# EasyEDA Pro project 小智.epro, board ESP32-S3-V1_0_1
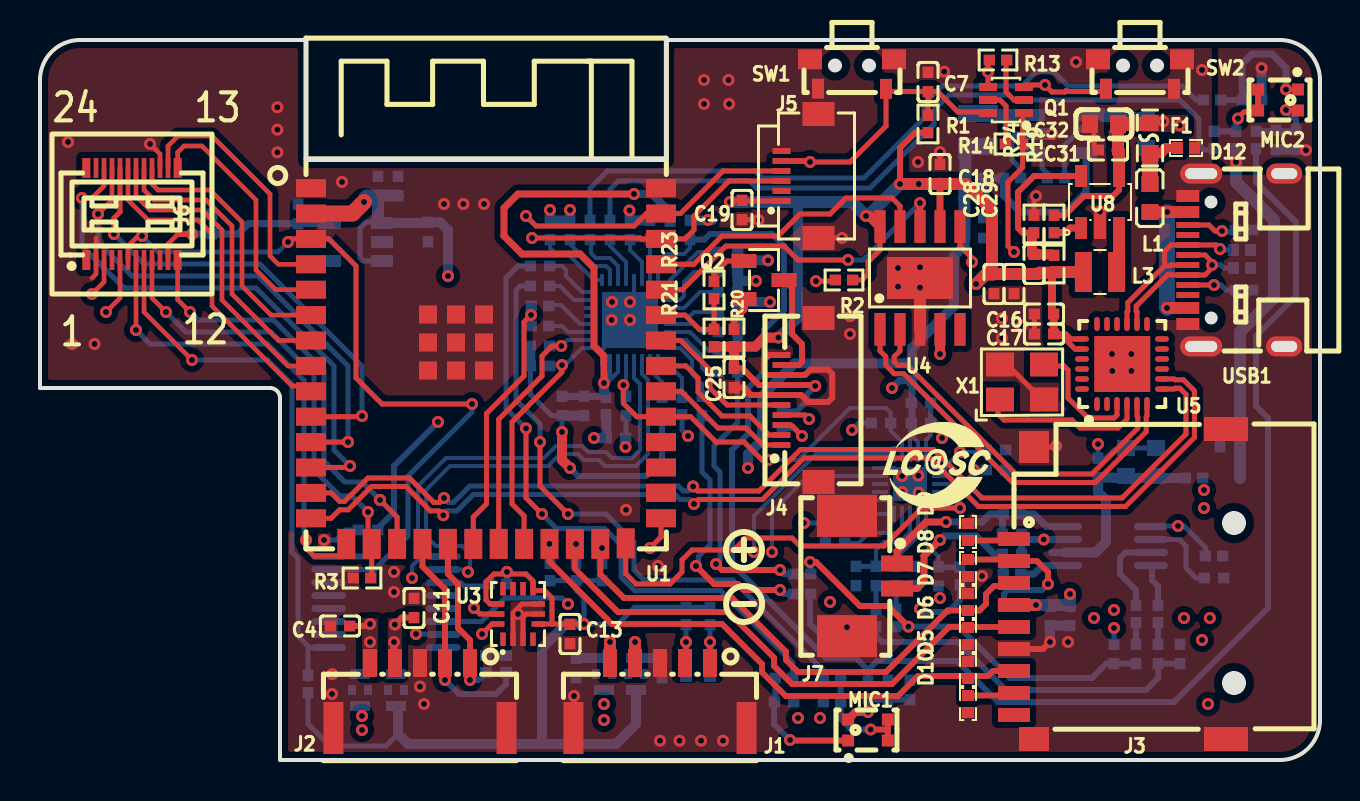
[diagram p3: board, top side]
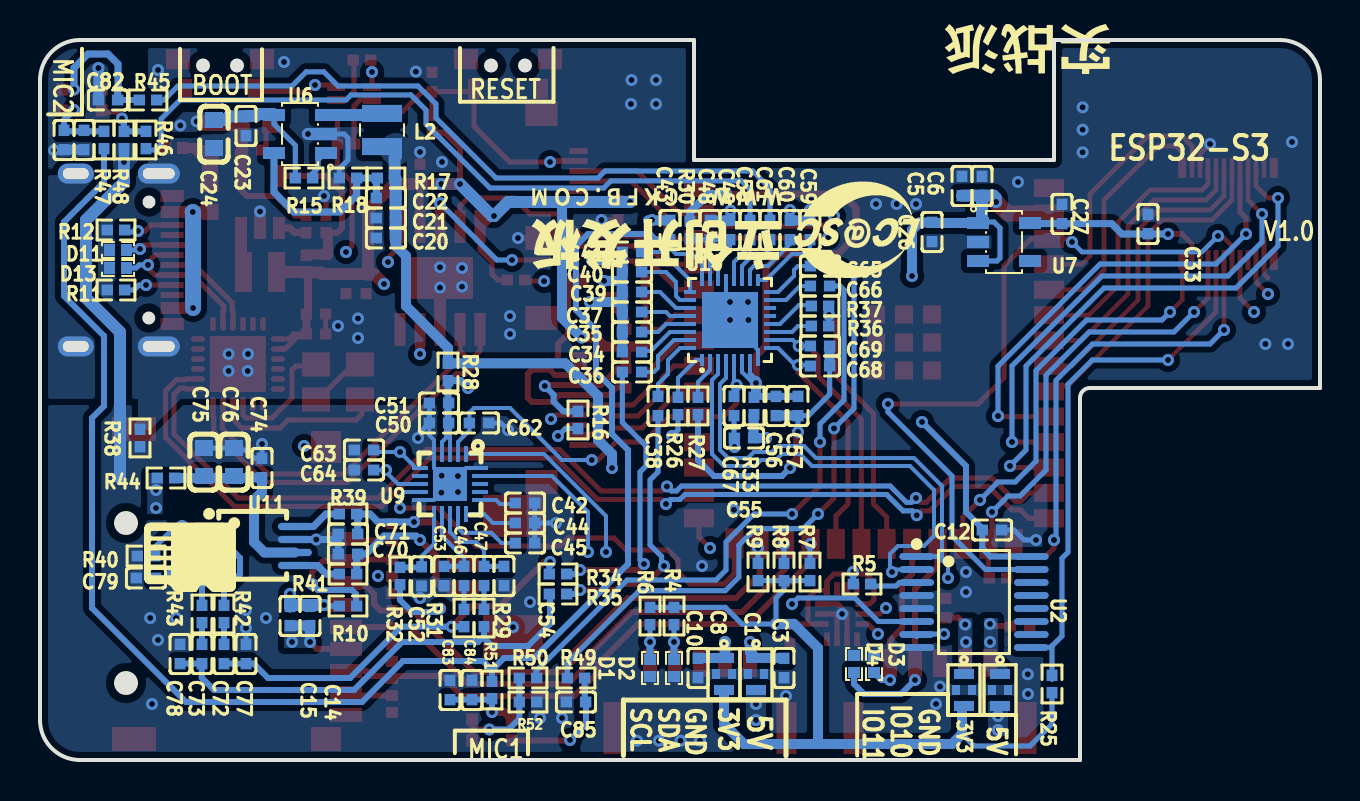
[diagram p4: board, bottom side, seen from below]

Outline 64 x 36 mm; copper layers: Top Layer, Inner1, Inner2, Bottom Layer. Coordinates in mm from the lower left corner of the outline.
Outline path: 0,34 0,18.6 11.5,18.6 arc(11.85,18.45) 12,18.1 12,0 62,0 arc(63.41,0.59) 64,2 64,34 arc(63.42,35.41) 62,36 31.3,36 31.3,30 13.3,30 13.3,36 2,36 arc(0.59,35.41) 0,34
Stack: Top Layer 0.035mm 外层铜厚1oz / Dielectric1 0.2104mm 7628 RC49% 8.6mil / Inner1 0.0152mm 内层铜厚 / Dielectric2 1.065mm 1.1mm H/HOZ 含铜 / Inner2 0.0152mm 内层铜厚 / Dielectric3 0.2104mm 7628 RC49% 8.6mil / Bottom Layer 0.035mm 外层铜厚1oz

## Design rules (mm)
net IO19_USB_D-: DP2
net IO20_USB_D+: DP2
net USB_D-: DP1
net USB_D+: DP1
net CH340_D-: DP3
net CH340_D+: DP3
template: 自定义配置
spacing copperThickness1oz (default): track to track 0.15, other pairs 0.152 to 0.3
spacing copperThickness2oz: track to track 0.203, other pairs 0.152 to 0.3
track width copperThickness1oz (default): min 0.15, default 0.254, max 2.54
track width copperThickness2oz: min 0.203, default 0.254, max 2.54
differential pair differentialPair (default): width min 0.15, default 0.253, max 2.54; gap min 0.17, default 0.17
via viaSize (default): diameter min 0.5, default 0.6, max 10; hole min 0.3, default 0.3, max 6.3

## Placement (name value [footprint] x y rotation side)
C1  NFM18PC104R1C3D  [FILTER-SMD_3P-L1.6-W0.8-L_NFM18CC223R1C3D]  28.2 4.3 270 bottom
C2  NFM18PC104R1C3D  [FILTER-SMD_3P-L1.6-W0.8-L_NFM18CC223R1C3D]  16 3.5 270 bottom
C3  100nF  [C0402]  26.8 4.6 270 bottom
C4  100nF  [C0402]  15 6.7 180 top
C5  10uF  [C0402]  17.9 28.7 90 bottom
C6  100nF  [C0402]  16.9 28.7 90 bottom
C7  1uF  [C0402]  44.4 33.9 90 top
C8  NFM18PC104R1C3D  [FILTER-SMD_3P-L1.6-W0.8-L_NFM18CC223R1C3D]  29.8 4.3 270 bottom
C9  NFM18PC104R1C3D  [FILTER-SMD_3P-L1.6-W0.8-L_NFM18CC223R1C3D]  17.8 3.5 270 bottom
C10  100nF  [C0402]  31.1 4.6 270 bottom
C11  100nF  [C0402]  18.7 7.6 90 top
C12  100nF  [C0402]  16.4 11.5 180 bottom
C13  100nF  [C0402]  26.5 6.3 90 top
C14  10uF  [C0402]  50.5 7.2 90 bottom
C15  100nF  [C0402]  51.5 7.2 90 bottom
C16  10uF  [C0402]  50.2 22.3 0 top
C17  100nF  [C0402]  50.2 21.3 180 top
C18  100nF  [C0402]  45 29.3 270 top
C19  100nF  [C0402]  35.1 27.5 90 top
C20  10uF  [C0402]  46.7 26.1 180 bottom
C21  100nF  [C0402]  46.7 27.1 0 bottom
C22  22pF  [C0402]  46.7 28.1 180 bottom
C23  100nF  [C0402]  53.7 31.7 270 bottom
C24  10uF  [C0603]  55.3 31.3 90 bottom
C25  100nF  [C0402]  34.7 19.1 270 top
C26  1uF  [C0402]  19.4 26.4 270 bottom
C27  1uF  [C0402]  12.9 27.3 90 bottom
C28  10uF  [C0402]  47.7 23.8 90 top
C29  100nF  [C0402]  48.7 23.8 270 top
C30  22pF  [C0402]  49.7 24.8 270 top
C31  100nF  [C0402]  53.4 30.5 180 top
C32  10uF  [C0603]  53.2 31.8 0 top
C33  100nF  [C0402]  8.6 26.8 270 bottom
C34  1uF  [C0402]  34.4 20.4 0 bottom
C35  1uF  [C0402]  34.4 21.4 0 bottom
C36  1uF  [C0402]  34.4 19.4 180 bottom
C37  1uF  [C0402]  34.4 22.4 0 bottom
C38  1uF  [C0402]  33.1 17.7 90 bottom
C39  1uF  [C0402]  34.4 23.4 0 bottom
C40  1uF  [C0402]  34.4 24.4 0 bottom
C41  1uF  [C0402]  34.4 25.4 0 bottom
C42  1uF  [C0402]  39.75 12.85 0 bottom
C43  1uF  [C0402]  32.5 26.5 90 bottom
C44  1uF  [C0402]  39.75 11.85 0 bottom
C45  1uF  [C0402]  39.75 10.85 0 bottom
C46  1uF  [C0402]  42.8 9.2 90 bottom
C47  1uF  [C0402]  41.8 9.2 90 bottom
C48  1uF  [C0402]  30.5 26.5 90 bottom
C49  1uF  [C0402]  29.5 26.5 90 bottom
C50  100nF  [C0402]  44.05 16.85 180 bottom
C51  100nF  [C0402]  44.05 17.85 180 bottom
C52  1uF  [C0402]  44.92 9.18 90 bottom
C53  22pF  [C0402]  43.8 9.2 90 bottom
C54  22pF  [C0402]  40.8 9.2 90 bottom
C55  1uF  [C0402]  28.8 16.1 180 bottom
C56  100nF  [C0402]  27.2 17.7 90 bottom
C57  100nF  [C0402]  26.1 17.7 90 bottom
C58  1uF  [C0402]  28.5 26.5 270 bottom
C59  1uF  [C0402]  25.5 26.5 90 bottom
C60  1uF  [C0402]  26.5 26.5 90 bottom
C61  1uF  [C0402]  27.5 26.5 270 bottom
C62  22pF  [C0402]  42.05 16.85 0 bottom
C63  22pF  [C0402]  47.8 15.5 180 bottom
C64  22pF  [C0402]  47.8 14.5 180 bottom
C65  1uF  [C0402]  25 24.7 0 bottom
C66  1uF  [C0402]  25 23.7 0 bottom
C67  22pF  [C0402]  29.3 17.7 90 bottom
C68  22pF  [C0402]  25 19.7 0 bottom
C69  22pF  [C0402]  25 20.7 0 bottom
C70  1nF  [C0402]  48.6 10.3 180 bottom
C71  1nF  [C0402]  48.6 11.3 180 bottom
C72  100nF  [C0402]  54.8 5.3 90 bottom
C73  100nF  [C0402]  55.9 5.3 90 bottom
C74  1uF  [C0402]  52.9 14.6 270 bottom
C75  22uF  [C0603]  55.8 14.9 90 bottom
C76  22uF  [C0603]  54.3 14.9 90 bottom
C77  22pF  [C0402]  53.7 5.3 270 bottom
C78  22pF  [C0402]  57 5.3 270 bottom
C79  1uF  [C0402]  58.7 9.1 180 bottom
C80  100nF  [C0402]  62.8 31 270 bottom
C81  10uF  [C0402]  61.8 31 90 bottom
C82  22pF  [C0402]  60.6 33 180 bottom
C83  100nF  [C0402]  43.5 3.5 90 bottom
C84  10uF  [C0402]  42.4 3.5 270 bottom
C85  22pF  [C0402]  37.2 2.9 180 bottom
D1  RCLAMP0521T-ES  [DFN1006-2L-BI]  33.5 4.6 270 bottom
D2  RCLAMP0521T-ES  [DFN1006-2L-BI]  32.3 4.6 270 bottom
D3  RCLAMP0521T-ES  [DFN1006-2L-BI]  22.3 4.8 90 bottom
D4  RCLAMP0521T-ES  [DFN1006-2L-BI]  23.3 4.8 90 bottom
D5  RCLAMP0521T-ES  [DFN1006-2L-BI]  46.4 4.5 90 top
D6  RCLAMP0521T-ES  [DFN1006-2L-BI]  46.4 6.2 270 top
D7  RCLAMP0521T-ES  [DFN1006-2L-BI]  46.4 7.9 90 top
D8  RCLAMP0521T-ES  [DFN1006-2L-BI]  46.4 9.6 270 top
D9  RCLAMP0521T-ES  [DFN1006-2L-BI]  46.4 11.4 90 top
D10  RCLAMP0521T-ES  [DFN1006-2L-BI]  46.4 2.8 270 top
D11  RCLAMP0521T-ES  [DFN1006-2L-BI]  60.1 25.5 180 bottom
D12  RCLAMP0521T-ES  [DFN1006-2L-BI]  57.3 30.6 180 top
D13  RCLAMP0521T-ES  [DFN1006-2L-BI]  60.1 24.6 180 bottom
F1  BSMD0603L-100  [F0603]  55.5 31.1 270 top
J1  HC-GH-5PWT  [CONN-SMD_5P-P1.25_HC-GH-5PWTKK]  31 3.3 180 top
J2  HC-GH-5PWT  [CONN-SMD_5P-P1.25_HC-GH-5PWTKK]  19 3.3 180 top
J3  TF PUSH  [TF-SMD_TF-PUSH]  54 8.8 90 top
J4  AFC34-S10FIA-00  [FPC-SMD_AFC34-S10FIA-00]  38 18 90 top
J5  AFC34-S06FIA-00  [FPC-SMD_AFC34-S06FIA-00]  38 29.2 90 top
J6  AXK724147G  [CONN-SMD_AXK724147G]  4.6 27.3 0 top
J7  X9821WRS-02-9TSN  [CONN-SMD_2P-P1.25_X9821WRS-02-9TSN]  41.6 9.2 270 top
L1  UPZ1608U221-2R2TF  [L0603]  55.5 28.1 90 top
L2  2.2uH  [IND-SMD_L2.5-W2.0-VLS252012CX-150M]  46.9 31.5 90 bottom
L3  2.2uH  [IND-SMD_L2.5-W2.0-VLS252012CX-150M]  53 24.4 0 top
MIC1  ZTS6216  [MIC-SMD_4P-L2.8-W1.9-P1.84-TL]  41.4 1.5 90 top
MIC2  ZTS6216  [MIC-SMD_4P-L2.8-W1.9-P1.84-TL]  61.9 33 270 top
Q1  LMBT3904DW1T1G  [SOT-363_L2.0-W1.3-P0.65-LS2.1-BR]  48.3 33 0 top
Q2  SI2301CDS-T1-GE3-ES  [SOT-23-3_L2.9-W1.3-P1.90-LS2.4-BR]  36.2 24 180 top
R1  10kΩ  [R0402]  44.4 31.8 90 top
R2  10kΩ  [R0402]  40.2 24 180 top
R3  10kΩ  [R0402]  16.1 9.1 0 top
R4  1kΩ  [R0402]  32.3 7.2 270 bottom
R5  10kΩ  [R0402]  22.9 8.8 180 bottom
R6  1kΩ  [R0402]  33.5 7.2 270 bottom
R7  51kΩ  [R0402]  25.5 9.4 270 bottom
R8  51kΩ  [R0402]  26.8 9.4 270 bottom
R9  51kΩ  [R0402]  28.1 9.4 270 bottom
R10  51kΩ  [R0402]  48.6 7.7 0 bottom
R11  5.1kΩ  [R0402]  60.2 23.5 180 bottom
R12  5.1kΩ  [R0402]  60.2 26.5 0 bottom
R13  10kΩ  [R0402]  47.9 35 180 top
R14  10kΩ  [R0402]  48.7 30.8 0 top
R15  10kΩ  [R0402]  50.8 29.1 0 bottom
R16  10kΩ  [R0402]  37.1 17 90 bottom
R17  680kΩ  [R0402]  46.7 29.1 180 bottom
R18  150kΩ  [R0402]  48.6 29.1 180 bottom
R19  10kΩ  [R0402]  50.7 26.8 90 top
R20  10Ω  [R0402]  34.7 21.1 90 top
R21  10kΩ  [R0402]  33.7 21.1 270 top
R22  680kΩ  [R0402]  50.7 24.8 270 top
R23  1kΩ  [R0402]  33.7 23.5 90 top
R24  150kΩ  [R0402]  49.7 26.8 270 top
R25  10kΩ  [R0402]  13.4 3.8 270 bottom
R26  10kΩ  [R0402]  32.1 17.7 270 bottom
R27  10kΩ  [R0402]  31.1 17.7 270 bottom
R28  0Ω  [R0402]  43.6 19.4 270 bottom
R29  0Ω  [R0402]  41.8 7.1 270 bottom
R30  0Ω  [R0402]  31.5 26.5 90 bottom
R31  0Ω  [R0402]  42.8 7.1 270 bottom
R32  0Ω  [R0402]  46 9.2 90 bottom
R33  0Ω  [R0402]  28.3 17.7 90 bottom
R34  0Ω  [R0402]  38.1 9.3 180 bottom
R35  0Ω  [R0402]  38.1 8.3 180 bottom
R36  51Ω  [R0402]  25 21.7 0 bottom
R37  0Ω(NC)  [R0402]  25 22.7 0 bottom
R38  0Ω  [R0402]  59 16.1 90 bottom
R39  0Ω  [R0402]  48.6 12.3 180 bottom
R40  10kΩ  [R0402]  58.7 10.2 0 bottom
R41  0Ω  [R0402]  48.6 9.3 180 bottom
R42  100kΩ  [R0402]  54.8 7.3 270 bottom
R43  100kΩ  [R0402]  55.9 7.3 270 bottom
R44  0Ω  [R0402]  57.7 14.1 0 bottom
R45  0Ω  [R0402]  58.6 33 0 bottom
R46  0Ω  [R0402]  58.7 31 90 bottom
R47  0Ω  [R0402]  60.8 31 270 bottom
R48  0Ω  [R0402]  59.8 31 90 bottom
R49  0Ω  [R0402]  37.2 4.1 180 bottom
R50  0Ω  [R0402]  39.6 4.1 0 bottom
R51  0Ω  [R0402]  41.4 3.5 90 bottom
R52  0Ω  [R0402]  39.6 2.9 0 bottom
SW1  TS-1010-C-A  [KEY-SMD_TX-1010-X-X]  40.6 34.4 0 top
SW2  TS-1010-C-A  [KEY-SMD_TX-1010-X-X]  55 34.4 0 top
U1  ESP32-S3-WROOM-1-N16R8  [WIRELM-SMD_ESP32-S3-WROOM-1]  22.3 19.7 0 top
U2  PCA9557PW,118  [TSSOP-16_L5.0-W4.4-P0.65-LS6.4-BL]  17.3 7.9 270 bottom
U3  QMI8658A  [LGA-14_L3.0-W2.5-P0.50-TL]  23.9 7.3 90 top
U4  CH340K  [ESOP-10_L4.9-W3.9-P1.00-LS6.0-BL-EP]  44 24.1 0 top
U5  CH334F  [QFN-24_L4.0-W4.0-P0.50-BL-EP2.8]  54.1 19.8 0 top
U6  SY8088AAC  [SOT-23-5_L3.0-W1.7-P0.95-LS2.8-BR]  51 31.3 180 bottom
U7  ME6211C28M5G-N  [SOT-23-5_L3.0-W1.7-P0.95-LS2.8-BR]  15.8 25.9 0 bottom
U8  SY8088AAC  [SOT-23-5_L3.0-W1.7-P0.95-LS2.8-BR]  53 27.9 270 top
U9  ES8311  [WQFN-20_L3.0-W3.0-P0.40-BL-EP1.7]  43.5 13.8 0 bottom
U10  ES7210  [QFN-32_L4.0-W4.0-P0.40-BL-EP2.7]  29.5 22 180 bottom
U11  NS4150B  [MSOP-8_L3.0-W3.0-P0.65-LS5.0-BL]  53.4 10.7 270 bottom
USB1  TYPEC-304-ACP16  [USB-C-SMD_TYPE-C-16P-1]  59.8 25 90 top
X1  12MHz  [OSC-SMD_4P-L3.2-W2.5-BL]  49.1 18.9 0 top

## Footprints (pads in the part's own frame, mm; a bottom-side part is the same pattern mirrored in y, then rotated)
C0402
  rect 0.566x0.54 smd: 1(-0.481,0) 2(0.481,0)
C0603
  rect 0.8x0.9 smd: 1(-0.7,0) 2(0.7,0)
CONN-SMD_2P-P1.25_X9821WRS-02-9TSN
  rect 0.8x1.6 smd: 1(-0.625,1.25) 2(0.625,1.25)
  rect 2.1x3 smd: 3(3.005,-1.25) 4(-3.005,-1.25)
CONN-SMD_5P-P1.25_HC-GH-5PWTKK
  rect 0.7x1.4 smd: 1(-2.5,-1.55) 2(-1.25,-1.55) 3(0,-1.55) 4(1.25,-1.55) 5(2.5,-1.55)
  rect 1x2.6 smd: 6(-4.33,1.7) 7(4.33,1.7)
CONN-SMD_AXK724147G
  rect 0.4x1 smd: 1(-2.285,-2.3) 12(2.285,-2.3) 13(2.285,2.3) 24(-2.285,2.3)
  rect 0.23x1 smd: 2(-1.8,-2.3) 3(-1.399,-2.3) 4(-1,-2.3) 5(-0.6,-2.3) 6(-0.2,-2.3) 7(0.201,-2.3) 8(0.601,-2.3) 9(1,-2.3) 10(1.4,-2.3) 11(1.8,-2.3) 14(1.8,2.3) 15(1.4,2.3) 16(1,2.3) 17(0.601,2.3) 18(0.201,2.3) 19(-0.2,2.3) 20(-0.6,2.3) 21(-1,2.3) 22(-1.399,2.3) 23(-1.8,2.3)
DFN1006-2L-BI
  rect 0.55x0.6 smd: 1(-0.425,0) 2(0.425,0)
ESOP-10_L4.9-W3.9-P1.00-LS6.0-BL-EP
  rect 0.56x1.64 smd: 1(-2,-2.57) 2(-1,-2.57) 3(0,-2.57) 4(1,-2.57) 5(2,-2.57) 6(2,2.57) 7(1,2.57) 8(0,2.57) 9(-1,2.57) 10(-2,2.57)
  rect 3.3x2.1 smd: 11(0,0)
F0603
  rect 0.806x0.864 smd: 1(-0.753,0) 2(0.753,0)
FILTER-SMD_3P-L1.6-W0.8-L_NFM18CC223R1C3D
  rect 0.5x1 smd: 1(-0.8,0) 3(0.8,0)
  rect 0.5x0.4 smd: 2(0,-0.4) 2(0,0.4)
FPC-SMD_AFC34-S06FIA-00
  rect 0.3x0.9 smd: 1(-1.25,0.925) 2(-0.75,0.925) 3(-0.25,0.925) 4(0.25,0.925) 5(0.75,0.925) 6(1.25,0.925)
  rect 1.2x1.6 smd: 7(3.1,-0.925) 8(-3.1,-0.925)
FPC-SMD_AFC34-S10FIA-00
  rect 0.3x0.9 smd: 1(-2.25,0.925) 2(-1.75,0.925) 3(-1.25,0.925) 4(-0.75,0.925) 5(-0.25,0.925) 6(0.25,0.925) 7(0.75,0.925) 8(1.25,0.925) 9(1.75,0.925) 10(2.25,0.925)
  rect 1.2x1.6 smd: 11(4.1,-0.925) 12(-4.1,-0.925)
IND-SMD_L2.5-W2.0-VLS252012CX-150M
  rect 0.85x2 smd: 1(-0.83,0) 2(0.83,0)
KEY-SMD_TX-1010-X-X
  rect 0.6x1 smd: 1(-1.7,-0.835) 2(1.7,-0.845)
  rect 1.2x1 smd: 3(-2.1,0.635) 4(2.1,0.635)
L0603
  rect 0.8x0.864 smd: 1(-0.7,0) 2(0.7,0)
LGA-14_L3.0-W2.5-P0.50-TL
  rect 0.675x0.28 smd: 1(-1.262,0.75) 2(-1.262,0.25) 3(-1.262,-0.25) 4(-1.262,-0.75) 8(1.262,-0.75) 9(1.262,-0.25) 10(1.262,0.25) 11(1.262,0.75)
  rect 0.28x0.675 smd: 5(-0.5,-1.012) 6(0,-1.012) 7(0.5,-1.012) 12(0.5,1.012) 13(0,1.012) 14(-0.5,1.012)
MIC-SMD_4P-L2.8-W1.9-P1.84-TL
  rect 0.6x0.6 smd: 1(-0.525,0.995) 2(-0.525,-0.995) 3(0.525,-0.995) 4(0.525,0.995)
MSOP-8_L3.0-W3.0-P0.65-LS5.0-BL
  oval 0.364x1.692 smd: 1(-0.975,-2.146) 2(-0.325,-2.146) 3(0.325,-2.146) 4(0.975,-2.146) 5(0.975,2.146) 6(0.325,2.146) 7(-0.325,2.146) 8(-0.975,2.146)
OSC-SMD_4P-L3.2-W2.5-BL
  rect 1.4x1.2 smd: 1(-1.1,-0.875) 2(1.1,-0.875) 3(1.1,0.875) 4(-1.1,0.875)
QFN-24_L4.0-W4.0-P0.50-BL-EP2.8
  oval 0.28x0.7 smd: 1(-1.25,-2) 2(-0.75,-2) 3(-0.25,-2) 4(0.25,-2) 5(0.75,-2) 6(1.25,-2) 13(1.25,2) 14(0.75,2) 15(0.25,2) 16(-0.25,2) 17(-0.75,2) 18(-1.25,2)
  oval 0.7x0.28 smd: 7(2,-1.25) 8(2,-0.75) 9(2,-0.25) 10(2,0.25) 11(2,0.75) 12(2,1.25) 19(-2,1.25) 20(-2,0.75) 21(-2,0.25) 22(-2,-0.25) 23(-2,-0.75) 24(-2,-1.25)
  rect 2.8x2.8 smd: 25(0.013,0)
QFN-32_L4.0-W4.0-P0.40-BL-EP2.7
  rect 0.2x0.6 smd: 1(-1.4,-2) 2(-1,-2) 3(-0.6,-2) 4(-0.2,-2) 5(0.2,-2) 6(0.6,-2) 7(1,-2) 8(1.4,-2) 17(1.4,2) 18(1,2) 19(0.6,2) 20(0.2,2) 21(-0.2,2) 22(-0.6,2) 23(-1,2) 24(-1.4,2)
  rect 0.6x0.2 smd: 9(2,-1.4) 10(2,-1) 11(2,-0.6) 12(2,-0.2) 13(2,0.2) 14(2,0.6) 15(2,1) 16(2,1.4) 25(-2,1.4) 26(-2,1) 27(-2,0.6) 28(-2,0.2) 29(-2,-0.2) 30(-2,-0.6) 31(-2,-1) 32(-2,-1.4)
  rect 2.8x2.8 smd: 33(0,0)
R0402
  rect 0.566x0.54 smd: 1(-0.433,0) 2(0.433,0)
SOT-23-3_L2.9-W1.3-P1.90-LS2.4-BR
  rect 1.25x0.7 smd: 1(1,-0.95) 2(1,0.95) 3(-1,0)
SOT-23-5_L3.0-W1.7-P0.95-LS2.8-BR
  rect 1.1x0.6 smd: 1(1.3,-0.95) 2(1.3,0) 3(1.3,0.95) 4(-1.3,0.95) 5(-1.3,-0.95)
SOT-363_L2.0-W1.3-P0.65-LS2.1-BR
  rect 0.9x0.4 smd: 1(0.9,-0.65) 2(0.9,0) 3(0.9,0.65) 4(-0.9,0.65) 5(-0.9,0) 6(-0.9,-0.65)
TF-SMD_TF-PUSH
  rect 0.7x1.6 smd: 1(2.25,5.3) 2(1.15,5.3) 3(0.05,5.3) 4(-1.05,5.3) 5(-2.15,5.3) 6(-3.25,5.3) 7(-4.35,5.3) 8(-5.45,5.3) CD(-6.55,5.3)
  rect 1.2x1.5 smd: 10(-7.75,4.3)
  rect 1.2x2.2 smd: 11(-7.75,-5.3) 12(7.75,-5.3)
  rect 1.6x1.5 smd: 13(6.85,4.3)
TSSOP-16_L5.0-W4.4-P0.65-LS6.4-BL
  oval 0.343x1.732 smd: 1(-2.275,-2.866) 2(-1.625,-2.866) 3(-0.975,-2.866) 4(-0.325,-2.866) 5(0.325,-2.866) 6(0.975,-2.866) 7(1.625,-2.866) 8(2.275,-2.866) 9(2.275,2.866) 10(1.625,2.866) 11(0.975,2.866) 12(0.325,2.866) 13(-0.325,2.866) 14(-0.975,2.866) 15(-1.625,2.866) 16(-2.275,2.866)
USB-C-SMD_TYPE-C-16P-1
  rect 0.6x1.15 smd: A1B12(-3.2,2.41) A4B9(-2.4,2.41) B1A12(3.2,2.41) B4A9(2.4,2.41)
  rect 0.3x1.15 smd: A5(-1.25,2.41) A6(-0.25,2.41) A7(0.25,2.41) A8(1.25,2.41) B5(1.75,2.41) B6(0.75,2.41) B7(-0.75,2.41) B8(-1.75,2.41)
  oval 1x2.1 hole 0.55x1.6: EP(-4.32,1.74) EP(4.32,1.74)
  oval 1x1.8 hole 0.55x1.3: EP(-4.32,-2.41) EP(4.32,-2.41)
WIRELM-SMD_ESP32-S3-WROOM-1
  rect 1.5x0.9 smd: 1(-8.75,8.895) 2(-8.75,7.625) 3(-8.75,6.355) 4(-8.75,5.085) 5(-8.75,3.815) 6(-8.75,2.545) 7(-8.75,1.275) 8(-8.75,0.005) 9(-8.75,-1.265) 10(-8.75,-2.535) 11(-8.75,-3.805) 12(-8.75,-5.075) 13(-8.75,-6.345) 14(-8.75,-7.615) 27(8.75,-7.615) 28(8.75,-6.345) 29(8.75,-5.075) 30(8.75,-3.805) 31(8.75,-2.535) 32(8.75,-1.265) 33(8.75,0.005) 34(8.75,1.275) 35(8.75,2.545) 36(8.75,3.815) 37(8.75,5.085) 38(8.75,6.355) 39(8.75,7.625) 40(8.75,8.895)
  rect 0.9x1.5 smd: 15(-6.985,-8.895) 16(-5.715,-8.895) 17(-4.445,-8.895) 18(-3.175,-8.895) 19(-1.905,-8.895) 20(-0.635,-8.895) 21(0.635,-8.895) 22(1.905,-8.895) 23(3.175,-8.895) 24(4.445,-8.895) 25(5.715,-8.895) 26(6.985,-8.865)
  rect 0.9x0.9 smd: 41(-2.9,2.575) 41(-2.9,1.175) 41(-2.9,-0.225) 41(-1.5,2.575) 41(-1.5,1.175) 41(-1.5,-0.225) 41(-0.1,2.575) 41(-0.1,1.175) 41(-0.1,-0.225)
WQFN-20_L3.0-W3.0-P0.40-BL-EP1.7
  rect 0.2x0.8 smd: 1(-0.8,-1.5) 2(-0.4,-1.5) 3(0,-1.5) 4(0.4,-1.5) 5(0.8,-1.5) 11(0.8,1.5) 12(0.4,1.5) 13(0,1.5) 14(-0.4,1.5) 15(-0.8,1.5)
  rect 0.8x0.2 smd: 6(1.5,-0.8) 7(1.5,-0.4) 8(1.5,0) 9(1.5,0.4) 10(1.5,0.799) 16(-1.5,0.8) 17(-1.5,0.4) 18(-1.5,0) 19(-1.5,-0.4) 20(-1.5,-0.8)
  rect 1.7x1.7 smd: 21(0,0)

## Nets
As in the schematic.

Pads without a net: J3 CD; J5 2; J6 1 4 10 23 24; U1 28 29 30; U2 10 11 12 13 14; U3 1 4 9 10 11; U4 5; U5 1 2 9 10 11 12 13 16 17 18 21 22 23 24; U7 4; U9 7 17 18; U10 13 14; USB1 A8 B8

## Via types
v1: diameter 0.6, hole 0.3, Top Layer to Bottom Layer, 210 vias
v2: diameter 0.61, hole 0.305, Top Layer to Bottom Layer, 6 vias

## Routing (per net, layer and track width the routed paths; a pad name or vN(x,y) marks a point on that pad's centre or on a via; arc(x,y) is an arc through that point)
2V8: length 9.4
  Top Layer w0.23: 6.9,26.3 6.4,25.8 J6.11
  Top Layer w0.3: v1(7.6,26.3) 6.9,26.3
  Bottom Layer w0.35: v1(7.6,26.3) 8.58,26.3 C33.2 8.62,26.3 9.9,26.3 10.42,26.82 C27.1 14.47,26.82 U7.5
3V3: length 200.6
  Top Layer w0.254: 25.6,6.8 v1(27.2,6.8) ; 25.6,6.8 24.82,6.8 ; 25.6,6.8 25.6,8.1 25.23,8.47 24.65,8.47 24.65,8.95 24.3,9.3 22.7,9.3 22.3,8.9 22.3,8 22.5,7.8 22.98,7.8 ; 51,21.3 51.1,21.2 ; v1(34.5,27.9) 34.58,27.98 C19.2 35.13,27.95 J5.1 ; U4.10 42,25.5 41.4,24.9 41.4,24.3 41.1,24 R2.1
  Top Layer w0.26: U5.20 51.75,20.55 51.1,21.2 ; C17.1 50.79,21.19 51,21.19 51,21.3 51.3,21.3 51.55,21.05 U5.19
  Top Layer w0.3: 44.4,31.37 43.77,31.37 43,30.6 v1(43,28.8) ; C25.1 35.12,19.58 35.95,18.75 J4.7 38.71,18.75 v1(38.76,18.7)
  Top Layer w0.35: C18.2 U4.7
  Top Layer w0.4: 50.6,24.37 50.6,22.38 C16.2 C17.1
  Top Layer w0.5: v1(41.3,27.2) 41.47,27.2 U4.10 ; v1(36.92,21.12) 36.22,21.12 35.77,20.67 34.7,20.67 ; 33.7,20.67 34.7,20.67 ; 34.7,20.67 C25.1
  Top Layer w0.6: 47.6,24.28 47.28,24.28 v1(46.8,23.8) ; 47.6,24.28 C28.2 ; 47.6,24.28 47.6,24.3 ; 47.6,24.3 47.6,27.5 46.3,28.8 45.02,28.8 ; 47.6,24.3 49.9,24.3 49.97,24.37 50.6,24.37 50.63,24.4 L3.1 ; J3.4 v1(49.8,7.75) ; C18.2 44.98,28.8 v1(43.94,28.8) v1(43,28.8)
  Top Layer w0.8: v2(16.2,27.9) 15.62,27.33 U1.2
  Inner1 w1: v1(20.4,24.2) 25.5,24.2 26.5,25.2 33.8,25.2 34.8,26.2 34.8,27.6 v1(34.5,27.9)
  Inner2 w1: v1(46.8,23.8) 46.8,19.3 48.1,18 48.1,14.8 51.5,11.4 v1(51.5,8.3) ; 27.3,6.7 27.05,6.45 26.05,6.45 25.2,7.3 25.2,9.4 23.1,11.5 23.1,13.7 v1(19.9,16.9) 19.19,17.61 19.19,18.41 18.1,19.5 18.1,22.9 19.4,24.2 v1(20.4,24.2)
  Bottom Layer w0.254: 17.9,1.3 17.3,0.7 14.5,0.7 13.4,1.8 13.4,3.37 ; U7.1 17.05,26.9 16.3,26.9 16,26.6 16,25.1 16.15,24.95 U7.3 ; 33.5,7.63 29.73,7.63 28.9,6.8 v1(27.2,6.8) 27.2,8.1 26.8,8.5 R8.2 ; R7.2 R8.2 ; R8.2 R9.2
  Bottom Layer w0.293: v1(49.8,7.75) 49.75,7.7 R10.2
  Bottom Layer w0.3: v1(38.76,18.7) 38.32,18.26 38.32,17.92 37.83,17.43 R16.2 ; v1(19.9,16.9) 17.7,14.7 17.7,12.4 16.88,11.58 16.88,10.58 16.47,10.17 U2.16 ; v1(23.35,9.41) 23.35,8.81 R5.1
  Bottom Layer w0.5: 25.1,0.8 25.1,0.8 25.1,5.6 26.3,6.8 v1(27.2,6.8) ; 25.1,0.8 18.4,0.8 17.9,1.3 ; 25.1,0.8 28.8,0.8 29.8,1.8 29.8,3.3 ; 37.7,27.9 37.9,27.7 37.9,22.1 v1(36.92,21.12) ; U7.1 19.37,26.85 C26.1 20.02,26.88 20.4,26.5 v1(20.4,24.2) ; 17.9,1.5 17.9,2.7
  Bottom Layer w0.6: C6.1 16.32,28.22 16.2,28.1 ; C6.1 16.9,26.9 ; C6.1 C5.1 ; v1(51.5,8.3) C15.2 51.43,7.75 v1(49.8,7.75) ; v1(43,28.8) 41.4,27.2 v1(41.3,27.2) 40.6,27.9 v1(34.5,27.9)
GND: length 43.1
  Top Layer w0.23: v1(5.5,30.8) 6,30.3 J6.15 ; 2.6,24.1 2.8,24.3 J6.2 2.8,26.1
  Top Layer w0.254: 24.15,6.13 24.15,7.15 24.3,7.3 24.82,7.3 ; v1(49.8,28.2) 49.7,28.1 R24.1 ; 23.65,6.13 23.65,7.35 24.1,7.8 24.82,7.8 ; C18.1 v1(45,30.4) ; J3.13 50.75,15.65 v1(50.8,15.7) ; v1(35.93,27) 35.91,27.02 C19.1 ; X1.2 50.1,18.03 48.35,19.78 X1.4 ; C32.1 52.7,31.6 52.7,30.72 C31.2 ; J5.8 v1(40.1,26.1) ; C17.2 C16.1
  Top Layer w0.3: v1(50.5,5.9) 50.15,5.55 J3.6 ; C25.2 35.18,18.62 35.55,18.25 J4.6 38.05,18.25 38.4,17.9 39.4,17.9 39.61,18.11 39.61,19.3 39.4,19.51 38.51,19.51 38.25,19.25 J4.8 36.35,19.25 36.2,19.4 36.2,20 36.45,20.25 J4.10
  Top Layer w0.6: U8.2 v1(53,27.42) ; U4.3 v1(44,23.62) U4.11
  Bottom Layer w0.254: v1(14.2,11) 14.8,11 15.3,11.5 C12.2 ; R18.1 49.03,29.57 48.6,30 48.6,31.1 48.8,31.3 U6.2
  Bottom Layer w0.5: C15.1 C14.1 v1(50.5,5.9)
  Bottom Layer w0.6: U6.2 v1(50.6,31.3)
  vias: v1(1.4,30.9) v1(1.6,20.8) v1(2.73,20.8) v1(11.87,32.64) v1(11.87,31.52) v1(11.87,30.39) v1(14.61,4.29) v1(14.6,3.3) v1(15.1,28.9) v1(17.7,9.4) v1(17.7,8.4) v1(19,3.67) v1(19.2,2.8) v1(20.2,27.8) v1(21.17,27.8) v1(22.2,27.8) v1(23.9,7.3) v1(26.7,3.2) v1(29.3,12.51) v1(30.9,9.7) v1(31,0.96) v1(31.97,0.96) v1(33.05,0.96) v1(33.2,34) v1(33.2,32.8) v1(34.15,0.96) v1(34.43,34) v1(34.45,32.8) v1(40.35,6.64) v1(40.5,22.19) v1(40.5,21.3) v1(42.9,24.6) v1(42.9,23.67) v1(43.9,29.9) v1(44,24.64) v1(45.21,34.42) v1(47.1,9.2) v1(48.1,22.08) v1(48.1,21.1) v1(49.1,21.7) v1(51.4,5.9) v1(51.8,34.9) v1(53.6,20.3) v1(53.62,19.45) v1(54.57,20.3) v1(54.57,19.45) v1(58.1,34.5)
VBUS: length 97.5
  Top Layer w0.3: R19.2 51.23,27.23 52.2,28.2 53.65,28.2 53.95,28.5 U8.4
  Top Layer w0.6: U8.4 53.95,30.43 C31.1 53.9,30.52 C32.2
  Top Layer w0.7: F1.1 55.45,31.8 C32.2
  Inner2 w1: 58.1,13.3 58.1,10.6 62.3,6.4 62.3,2.5 60.7,0.9 44.9,0.9 41.6,4.2 36.64,4.2 35.44,3 28.4,3 v1(28.2,2.8) ; v1(56.98,31.73) 55,29.74 55,21.7 55.8,20.9 55.8,16.6 58,14.4 58,13.7 v1(58.2,13.5) 58.25,13.45 ; v1(16.1,1.5) 27.7,1.5 v1(28.2,2)
  Bottom Layer w0.254: U6.4 52.3,31.8 51.23,30.73 R15.2
  Bottom Layer w0.6: C24.2 54.73,32 54.55,32.18 C23.1 53.68,32.2 53.2,32.2 53.1,32.3 52.35,32.3 U6.4
  vias: v1(16.1,2.2) v1(56.17,31.93) v1(58.2,12.6)
ADC_3V3: length 34.6
  Top Layer w0.35: v1(29.7,28.3) 23.9,28.3 23.2,27.6 23.2,26.2 24.1,25.3 27,25.3 27.7,24.6 27.7,20.7 28.2,20.2 v1(28.2,18.85)
  Inner1 w1: v1(28.2,18.85) 28.2,18.01 28.91,17.3 30.2,17.3 31.3,16.2 v1(32.4,16.2)
  Bottom Layer w0.2: 28.5,19.3 U10.7 ; U10.6 28.9,19.4 28.45,18.95 28.2,18.95
  Bottom Layer w0.254: R26.2 32.1,16.5 v1(32.4,16.2) ; 28.2,18.95 28.2,19 28.5,19.3
  Bottom Layer w0.35: 28.3,18.13 28.25,18.18 C56.2 C57.2
  Bottom Layer w0.4: v1(29.7,28.3) 30.6,28.3 31.5,27.4 R30.2
  Bottom Layer w0.5: 28.25,18.18 28.2,18.23 28.2,18.95
ADC_MIC1N: length 30.3
  Top Layer w0.254: v1(26.4,12.3) 25,13.7 v1(25,15.9)
  Bottom Layer w0.254: v1(26.4,12.3) 28.3,12.3 29.7,10.9 29.7,9.5 30.2,9 34.64,9 39.2,4.44 39.2,4.08 ; v1(25,15.9) 25,16.8 23.8,18 23.8,23.5 24,23.7 C66.1
ADC_MIC1P: length 31.3
  Top Layer w0.254: v1(24.3,16.58) 24.3,13.1 v1(25.1,12.3)
  Bottom Layer w0.254: v1(24.3,16.58) 23.3,17.58 23.3,24.1 23.9,24.7 C65.1 ; v1(25.1,12.3) 25.83,11.57 28.23,11.57 29.06,10.74 29.06,9.14 29.74,8.46 34.04,8.46 37.63,4.87 R49.1
ADC_MIC2N: length 36.3
  Bottom Layer w0.254: R46.1 58.63,30.5 58.2,30.5 57.94,30.75 57.94,32.05 57,33 48.7,33 48.45,33.25 45.45,33.25 44.7,32.5 44.7,31.8 41.5,28.6 35.81,28.6 35.46,28.96 28.93,28.96 28.5,28.53 C58.1
ADC_MIC2P: length 36
  Bottom Layer w0.254: R45.1 57.8,33 57.1,33.7 51.4,33.7 50.69,34.41 49.81,34.41 49.1,33.7 45.1,33.7 44.2,32.8 44.2,32.1 41.2,29.1 36.1,29.1 35.75,29.45 28.37,29.45 27.5,28.58 C61.1
ADC_MIC3N: length 13.4
  Top Layer w0.3: v1(37,8.5) 35.2,8.5 34.9,8.8 33.7,8.8 v1(32.8,9.7)
  Bottom Layer w0.254: C38.1 33.1,14.4 33.5,14 33.5,10.76 32.92,10.18 32.92,9.82 v1(32.8,9.7)
  Bottom Layer w0.3: R35.2 37.2,8.3 v1(37,8.5)
ADC_MIC3P: length 14.4
  Top Layer w0.3: v1(33.8,9.8) 34.1,9.5 v1(37,9.5)
  Bottom Layer w0.254: C36.1 34.88,16.88 33.7,15.7 33.7,14.7 34,14.4 34,10 v1(33.8,9.8)
  Bottom Layer w0.3: v1(37,9.5) 37.21,9.29 37.59,9.29 37.67,9.37
ADC_MICBIAS12: length 82.6
  Bottom Layer w0.2: U10.24 30.9,24.8 31.4,25.3 32.2,25.3 32.5,25.6 C43.1
  Bottom Layer w0.3: 41.4,4.5 41.85,4.95 45.85,4.95 47.9,2.9 56.7,2.9 61.4,7.6 61.4,17.1 60.8,17.7 60.8,21.2 62.8,23.2 62.8,26.9 60.8,28.9 R47.2 ; 41.4,4.5 R51.2 ; 41.4,4.5 40.8,5.1 39.3,5.1 34.6,9.8 34.6,15.5 35.4,16.3 35.4,18.6 36.2,19.4 36.2,21.5 37.2,22.5 37.2,25.7 36.6,26.3 33.5,26.3 33.22,26.02 C43.1
AU_3V3: length 35.8
  Inner2 w1: v1(35.4,14.6) 35.2,14.8 32.1,14.8 31.8,14.5 28.2,14.5 27.7,15 v1(27.7,16.1)
  Bottom Layer w0.5: C20.2 46.22,25.72 45.7,25.2 45.7,22.7 43.6,20.6 43.6,19.83 37.73,19.83 36.1,18.2 36.1,16 35.4,15.3 v1(35.4,14.6) ; R33.1 28.32,17.25 C55.2 v1(27.7,16.1)
  Bottom Layer w0.6: C20.2 C21.1 C22.2 46.22,29.05 R17.2 46.27,30.13 46.2,30.2 46.2,30.54 46.44,30.78 46.78,30.78 L2.1
AU_GND: length 88.4
  Top Layer w0.5: v1(26.1,16.4) 26.1,15 v1(26.5,14.6)
  Inner1 w1: v1(29.28,15.65) 30.12,14.8 33.4,14.8 35.4,12.8 37.25,12.8 v1(38.2,11.85)
  Bottom Layer w0.2: U9.21 v1(43.1,14.2) 42.7,14.6 U9.20 ; U9.21 v1(43.93,13.37) 44.3,13 U9.10 ; U9.21 v1(43.91,14.22) 44.3,14.6 U9.5 44.3,16 44.53,16.23 C50.1 ; U10.8 28.1,20.5 28.2,20.6 28.2,20.7 v1(29.5,22) 29.7,22.2 U10.21
  Bottom Layer w0.254: v1(45.1,16.1) 45.1,16.28 C50.1 C51.1 ; v1(29.28,15.65) 29.28,15.66 C55.1 ; v1(40.6,16.5) 40.95,16.85 C62.1 ; C44.1 C45.1 ; C44.1 v1(38.2,11.85) ; C44.1 C42.1 ; v1(26.1,16.4) C57.1 25.58,17.22 24.52,18.28 C68.1 ; v1(52.9,15.8) C74.1 53.28,15.08 53.7,15.5 54.2,15.5 C76.2 C75.2 ; v1(29.47,27.48) 29.47,27.01 C49.2 ; C59.2 v1(25.5,27.5) ; C60.2 v1(26.5,27.5) ; C80.2 63.27,30.52 v1(63.3,30.49) ; C77.1 v1(53.7,6.6) ; 29.3,16.1 C67.1
  Bottom Layer w0.3: R27.2 31.1,15 30.3,14.2 26.9,14.2 v1(26.5,14.6)
  Bottom Layer w0.35: U11.7 v1(50.19,11.03) 49.36,11.03 C71.1 C70.1
  Bottom Layer w0.5: 34.88,24.98 v1(36.4,24.98) ; 34.88,24.98 C40.2 34.88,23.95 ; 34.88,24.98 C41.2 ; C43.2 33.6,26.98 ; C34.2 C35.2 C37.2 34.88,22.9 ; 34.88,22.9 C39.2 34.88,23.95 ; 34.88,22.9 v1(36.5,22.9) ; C82.1 v1(61.08,34.6) ; C59.2 C60.2 ; C68.1 C69.1 ; 34.88,23.95 v1(35.8,23.95) ; C48.2 C49.2 ; C57.1 C56.1 ; C80.2 C81.1 ; R48.1 v1(59.8,29.9)
  Bottom Layer w0.6: v1(59.8,29.9) 59.8,28.9 61.7,27 61.7,23.1 60,21.4 60,14.1
  vias: v1(28.6,22.9) v1(28.58,22) v1(29.5,22.9) v1(33.4,27) v1(37.9,2.1) v1(39,2.1) v1(39.5,7.9) v1(43.1,13.4) v1(45,8.1) v1(52.7,7.1) v1(53.7,7.5) v1(57.2,7.1) v1(58.1,6) v1(58.4,2.8) v1(58.49,7.1)
CH340_D+: length 19.8
  Top Layer w0.253: U5.6 55.35,17.2 55.31,17.16 55.31,16.41 52.78,13.88 48.62,13.88 43.19,19.31 42.72,19.31 42.29,19.74 42.29,20.17 42,20.46 U4.1
CH340_D-: length 18.4
  Top Layer w0.253: U4.2 43,20.46 42.71,20.17 42.71,19.92 42.89,19.74 43.36,19.74 48.8,14.3 52.6,14.3 54.89,16.59 54.89,17.16 54.85,17.2 U5.5
CODEC_3V3: length 21.8
  Inner1 w1: v1(42.6,18.6) 41.9,17.9 41.9,9.67 v1(44,7.57)
  Bottom Layer w0.2: U9.4 43.9,15.9 43.7,16.1 43.7,16.72 C50.2 43.5,16.78 U9.3
  Bottom Layer w0.293: v1(44,7.57) 44.17,7.4 45.4,7.4 46,8 R32.1
  Bottom Layer w0.35: C50.2 43.6,16.88 R28.2 42.97,18.97 v1(42.6,18.6)
DTR: length 17.7
  Top Layer w0.254: Q1.4 v1(47.4,34.4) 47.4,34.93 R13.2
  Top Layer w0.5: U4.4 v1(45,20.3)
  Inner2 w0.3: v1(45,20.3) 45,27.1 47.4,29.5 v1(47.4,34.4)
DVP_PWDN: length 27.8
  Top Layer w0.23: v1(7.6,20) 5.2,22.4 J6.8
  Bottom Layer w0.254: 13.4,5.7 12.9,6.2 12.9,10.09 12.6,10.39 12.6,18.79 11.39,20 v1(7.6,20) ; 13.4,5.7 13.47,5.62 ; 13.4,5.7 13.4,4.03 ; 13.4,5.7 13.47,5.62 ; 13.47,5.62 U2.9
IO0_BOOT: length 46.6
  Top Layer w0.254: 31.05,12.08 31.05,11.15 v1(30.5,10.6) ; R2.2 39.71,23.94 v1(38.8,23.94) ; 53.3,33.42 51.34,33.42 51.3,33.47 51.23,33.4 50.6,33.4 v1(50.25,33.75) 49.3,33.75 Q1.3
  Inner2 w0.3: v1(50.25,33.75) 50.25,34.25 49.3,35.2 46.5,35.2 46.2,34.9 46.2,33.8 38.8,26.4 v1(38.8,23.94) 39.6,23.14 39.6,14.5 36.9,11.8 35.1,11.8 33.9,10.6 v1(30.5,10.6)
IO1_I2C_SDA: length 126.1
  Top Layer w0.23: v1(2.6,23.3) 3.2,23.9 J6.3
  Top Layer w0.254: v1(24.3,27.2) 24.8,26.7 29.7,26.7 30.32,27.33 U1.39 32.03,27.33 34.15,29.45 J5.4 ; v1(32.3,5.9) 32.3,4.9 J1.2 ; 22.98,6.8 22.6,6.8 v1(22.1,6.3)
  Inner2 w0.3: v1(36.6,10.4) 36.6,10.7 36.1,11.2 35.4,11.2 34.9,10.7 34.9,9.12 32.3,6.52 v1(32.3,5.9) 31.6,5.2 23.2,5.2 v1(22.1,6.3) 22.6,6.8 22.6,8.2 v1(21.4,9.4) 21.4,13.8 18,17.2 18,17.91 16.9,19.01 16.9,23.4 18.8,25.3 24.9,25.3 25.3,25.7 25.3,26.62 24.72,27.2 v1(24.3,27.2) 23.9,26.8 14.9,26.8 11.4,23.3 v1(2.6,23.3)
  Bottom Layer w0.2: v1(36.6,10.4) 36.6,12.4 38.4,14.2 U9.19 ; U10.3 30.1,19.3 30.4,19 30.4,15.3 29.8,14.7 28.25,14.7 27.95,15 27.2,15 26.9,15.3 26,15.3 25.4,14.7 20.5,14.7 19.3,13.5 19.3,11.2 19.8,10.7 21.1,10.7 21.5,10.3 21.5,9.5 v1(21.4,9.4) 21.28,9.53 U2.2
  Bottom Layer w0.254: v1(32.3,5.9) R4.2
  Bottom Layer w0.35: D2.1 v1(32.3,5.9)
IO2_I2C_SCL: length 119.2
  Top Layer w0.23: v1(3.3,22.4) 4,23.1 J6.5
  Top Layer w0.254: J1.1 v1(33.5,5.9) ; 22.98,7.3 22,7.3 v1(21.7,7.6) ; v1(24.6,26.1) 30,26.1 30.05,26.06 U1.38 32.25,26.06 32.7,26.5 32.7,27.2 34.45,28.95 J5.3
  Inner2 w0.3: 16.2,23.8 18.5,26.1 v1(24.6,26.1) ; 16.2,23.8 13.1,23.8 10.5,21.2 5.8,21.2 5.3,20.7 4.3,20.7 3.3,21.7 v1(3.3,22.4) ; 16.2,23.8 16.2,18.8 17.3,17.7 17.3,16.9 18.6,15.6 v1(18.6,9.1) 18.7,9.1 20.7,7.1 ; v1(21.7,7.6) 21.2,7.1 20.7,7.1 ; 20.7,7.1 21.2,6.6 21.2,6.18 22.78,4.6 32.8,4.6 33.5,5.3 v1(33.5,5.9) 35.7,8.1 v1(35.7,10.4)
  Bottom Layer w0.2: v1(18.6,9.1) 18.6,9.7 18.9,10 18.9,13.7 20.3,15.1 25.2,15.1 25.8,15.7 27.1,15.7 27.4,15.4 28.3,15.4 28.6,15.1 29.6,15.1 30,15.5 30,18.8 29.7,19.1 U10.4 ; U9.1 38.8,15.3 35.7,12.2 v1(35.7,10.4)
  Bottom Layer w0.254: 18.9,10 19.07,10.17 U2.1 ; v1(33.5,5.9) R6.2
  Bottom Layer w0.35: D1.1 v1(33.5,5.9)
IO3_DVP_VSYNC: length 24
  Top Layer w0.23: v1(4.8,21.5) J6.7
  Top Layer w0.254: v2(13.3,11) 13.3,10.6 13.7,10.2 15.1,10.2 15.31,10.42 U1.15
  Bottom Layer w0.254: v2(13.3,11) 13.2,11.1 13.2,18.98 11.38,20.8 5.5,20.8 v1(4.8,21.5)
IO4_DVP_D6: length 12.9
  Top Layer w0.23: U1.4 11.91,24.78 11.5,25.2 11.5,28.3 8.6,31.2 6.9,31.2 6.4,30.7 J6.14
IO5_DVP_XCLK: length 12.6
  Top Layer w0.23: U1.5 11.78,23.52 10.8,24.5 10.8,28 8.1,30.7 7.2,30.7 6.89,30.39 J6.13
IO6_DVP_D5: length 13.3
  Top Layer w0.23: U1.6 11.56,22.25 10.1,23.7 10.1,26.9 8.5,28.5 5.9,28.5 5.6,28.8 J6.16
IO7_DVP_PCLK: length 14.6
  Top Layer w0.23: J6.17 5.2,28.5 5.7,28 8.3,28 9.6,26.7 9.6,23.3 11.93,20.97 U1.7
IO8_DVP_D2: length 27
  Top Layer w0.23: v1(2.1,28.1) 2.6,28.1 3.2,28.7 J6.22
  Top Layer w0.254: U1.12 15.43,14.62 v2(15.5,14.7)
  Bottom Layer w0.254: v1(2.1,28.1) 2.1,25.7 4.2,23.6 10.8,23.6 14.7,19.7 14.7,15.5 v2(15.5,14.7)
IO9_DVP_D7: length 21.5
  Top Layer w0.23: J6.12 6.89,23.02 v1(7.5,22.4)
  Top Layer w0.254: v2(17,13) 17.85,12.14 U1.17
  Bottom Layer w0.254: v1(7.5,22.4) 7.9,22 11.67,22 14.2,19.47 14.2,14.94 15.24,13.9 16.1,13.9 v2(17,13)
IO10: length 11.4
  Top Layer w0.3: J2.2 20.25,8.55 19.12,9.67 U1.18
  Top Layer w0.35: v1(20.25,4) J2.2
  Bottom Layer w0.3: D4.1 23.3,3.8 22.8,3.3 20.95,3.3 v1(20.25,4)
IO11: length 8.2
  Top Layer w0.3: v1(21.5,4) J2.1 21.5,6 20.9,6.6 20.9,8.8 20.4,9.31 U1.19
  Bottom Layer w0.3: D3.1 21.93,4 v1(21.5,4)
IO12_I2S_DI: length 14.2
  Top Layer w0.254: 21.66,10.81 21.66,12.15 22.33,12.81 22.33,17.33 24.2,19.2 24.2,21.9 v1(24.55,22.25)
  Bottom Layer w0.254: v1(24.55,22.25) 24.55,21.72 R36.1 R37.1
IO13_I2S_WS: length 40.7
  Top Layer w0.254: v1(26.06,20.7) 25.6,20.7 25.1,20.2 25.1,19.2 22.94,17.03 U1.21
  Inner1 w0.3: v1(26.06,20.7) 26.36,20.4 43.4,20.4 46.7,17.1 v1(46.7,14.5)
  Bottom Layer w0.2: U9.8 46.1,13.8 46.8,14.5 47.12,14.5 ; C69.2 v1(26.06,20.7) 26.36,21 U10.10
IO14_I2S_BCK: length 37.8
  Top Layer w0.254: v1(26.1,19.75) 26.1,19.4 23.6,16.9 23.6,12.81 24.21,12.2 U1.22
  Inner1 w0.3: v1(26.1,19.75) 43.15,19.75 46,16.9 v1(46,15.4)
  Bottom Layer w0.2: C68.2 25.53,19.75 v1(26.1,19.75) 26.25,19.75 27.1,20.6 U10.9 ; U9.6 45.2,14.6 v1(46,15.4) 47.22,15.4
IO15_DVP_D4: length 15.7
  Top Layer w0.23: U1.8 12.4,19.7 9.1,23 9.1,26.5 8.1,27.5 5.5,27.5 4.8,28.2 J6.18
IO16_DVP_D0: length 16.8
  Top Layer w0.23: J6.19 4.4,28 5.4,27 7.9,27 8.6,26.3 8.6,22.7 12.6,18.7 13.28,18.7 U1.9
IO17_DVP_D3: length 23.6
  Top Layer w0.254: U1.10 16.06,17.17 v2(16.1,17.2) ; J6.20 4,27.4 3.7,27.1 v1(3.7,26.3)
  Bottom Layer w0.254: v2(16.1,17.2) 16.1,19.69 10.99,24.8 5.2,24.8 v1(3.7,26.3)
IO18_DVP_D1: length 24.7
  Top Layer w0.23: v1(2.9,27.3) 3.6,28 J6.21
  Top Layer w0.254: U1.11 15.4,15.89 v2(15.4,15.9)
  Bottom Layer w0.254: v2(15.4,15.9) 15.4,19.7 10.9,24.2 4.6,24.2 2.9,25.9 v1(2.9,27.3)
IO19_USB_D-: length 52.2
  Top Layer w0.253: v1(32.65,13.68) 32.88,13.45 35.95,13.45 38.03,15.52 44.68,15.52 47.1,13.1 54.1,13.1 57.3,16.3 57.3,18.28 56.99,18.59 56.74,18.59 56.7,18.55 U5.7 ; v1(20.2,13.1) 19.98,12.88 19.69,12.88 18.47,14.1 16.4,14.1 15.23,12.93 14.98,12.93 14.55,13.36 U1.13
  Bottom Layer w0.253: v1(20.2,13.1) 20.42,12.88 20.67,12.88 21.49,13.7 31.92,13.7 32.17,13.45 32.43,13.45 v1(32.65,13.68)
IO20_USB_D+: length 53.6
  Top Layer w0.253: v1(32.7,12.8) 32.93,13.03 36.13,13.03 38.2,15.1 44.5,15.1 46.93,12.68 54.28,12.68 57.72,16.12 57.72,18.46 57.17,19.01 56.74,19.01 56.7,19.05 U5.8 ; v1(20.16,12.24) 19.94,12.46 19.51,12.46 18.3,13.68 16.57,13.68 15.4,12.51 14.98,12.51 14.55,12.08 13.55,12.08
  Bottom Layer w0.253: v1(32.7,12.8) 32.47,13.03 32,13.03 31.75,13.28 21.67,13.28 20.85,12.46 20.38,12.46 v1(20.16,12.24)
IO21_SD_DAT0: length 28.6
  Top Layer w0.293: v1(25.47,10.81) 25.47,9.92 28.6,6.8 34.1,6.8 36.1,4.8 36.1,4.39 37.29,3.2 42.9,3.2 43.9,4.2 47.4,4.2 47.65,4.45 J3.7
  Bottom Layer w0.254: 25.5,9.83 25.5,10.8
IO38_I2S_MCK: length 20.9
  Top Layer w0.254: v1(29.17,18.75) 29.17,17.83 29.84,17.17 U1.31 32.53,17.17 33.8,15.9 35.2,15.9 36.1,15 v1(36.41,15)
  Bottom Layer w0.2: U9.2 43.1,15.9 42.53,16.47 C62.2 42.53,17.37 42.3,17.6 40.5,17.6 37.9,15 v1(36.41,15) ; v1(29.17,18.75) 29.3,18.88 U10.5
  Bottom Layer w0.254: C67.2 29.3,18.62 v1(29.17,18.75)
IO39_LCD_DC: length 7.1
  Top Layer w0.254: U1.32 32.06,18.44 33.9,16.6 35.3,16.6 36.15,15.75 J4.1
IO40_LCD_MOSI: length 7.9
  Top Layer w0.254: U1.33 32.29,19.7 32.9,19.1 32.9,18.4 34.1,17.2 35.5,17.2 36.45,16.25 J4.2
IO41_LCD_SCK: length 7.9
  Top Layer w0.254: U1.34 32.03,20.97 33.5,19.5 33.5,18.6 34.35,17.75 J4.5
IO42_LCD_BL: length 4.5
  Top Layer w0.254: U1.35 32.25,22.25 32.97,21.53 R21.1 R23.1
IO45_I2S_DO: length 22.4
  Top Layer w0.254: 29.28,10.83 29.28,9.31 29.8,8.8 31.5,8.8 32.1,9.4 32.1,10 32.6,10.5 34.7,10.5 35.3,11.1 37.6,11.1 38,10.7 42.2,10.7 44.1,12.6 v1(46,12.6)
  Bottom Layer w0.2: U9.9 45.8,13.4 46,13.2 v1(46,12.6)
IO46_DVP_HREF: length 23.3
  Top Layer w0.23: v1(6.3,22.4) 5.6,23.1 J6.9
  Top Layer w0.254: R3.2 16.59,9.15 U1.16 16.4,10.99 v1(16.4,12.4)
  Bottom Layer w0.254: v1(16.4,12.4) 15.6,13.2 15,13.2 13.7,14.5 13.7,19.24 11.54,21.4 7.3,21.4 v1(6.3,22.4)
IO47_SD_CLK: length 28
  Top Layer w0.293: U1.24 26.75,9.56 28.9,7.4 34.41,7.4 36.7,5.11 36.7,4.7 37.6,3.8 42.6,3.8 45.45,6.65 J3.5
  Bottom Layer w0.254: 26.8,9.83 v1(26.8,10.8)
IO48_SD_CMD: length 27.4
  Top Layer w0.293: U1.25 28.01,9.28 29.2,8.1 34.61,8.1 37.3,5.41 37.3,5 37.9,4.4 42.3,4.4 45.38,7.47 D7.1 46.97,7.47 47.3,7.8 47.3,8.3 47.7,8.7 48.55,8.7 J3.3
  Bottom Layer w0.254: 28.1,9.83 v1(28.1,10.6)
LCD_CS: length 25.8
  Top Layer w0.254: J4.3 37.55,16.75 37.62,16.68 37.64,16.68 37.8,16.52 37.8,16.5 v1(38.1,16.2)
  Inner2 w0.3: v1(38.1,16.2) 38.1,13.9 36.7,12.5 34.8,12.5 33.7,11.4 30,11.4 v1(26.4,7.8)
  Bottom Layer w0.254: v1(26.4,7.8) 26.1,8.1 23.25,8.1 22.08,6.92 20.17,6.92 ; v1(38.1,16.2) 37.73,16.57 R16.1
OUTN: length 23.3
  Bottom Layer w0.3: 38.5,8.27 38.5,6.8 39.6,5.7 41.4,5.7 41.8,6.1 41.8,6.2 ; 41.8,6.67 41.8,6.2 ; 41.8,6.2 42.1,5.9 45.9,5.9 48.3,3.5 55.3,3.5 55.91,4.11 55.91,4.81 C73.1 C78.2
OUTP: length 20
  Top Layer w0.3: v1(43.42,6.67) 42.39,7.7 41,7.7 38.8,9.9 v1(38.5,9.9)
  Bottom Layer w0.3: 42.8,6.67 v1(43.42,6.67) 45.93,6.67 48.5,4.1 52.6,4.1 53.32,4.82 C77.2 C72.1 ; v1(38.5,9.9) 38.53,9.87 38.53,9.5
PA_EN: length 61.3
  Inner2 w0.3: v1(18.8,6.3) 20.2,6.3 22.5,4 35,4 36.2,5.2 42,5.2 45.3,1.9 60.3,1.9 61.2,2.8 61.2,6 56.9,10.3 v1(56.9,11.7)
  Bottom Layer w0.254: 20.17,6.17 20.04,6.3 v1(18.8,6.3) ; U11.1 55.57,11.7 v1(56.9,11.7) 57.2,11.7 58.27,10.63 R40.1
RESET: length 89.7
  Top Layer w0.23: v1(5.1,26.2) 4.9,26.2 4.4,25.7 J6.6
  Top Layer w0.254: v1(12.4,25.9) 12.56,26.06 U1.3 14.44,26.06 15.8,24.7 15.8,19.1 17.1,17.8 v1(21.6,17.8) ; R1.2 C7.1 ; Q1.6 47.35,32.4 45.9,32.4 44.88,33.42 42.55,33.42 42.3,33.17 42.3,31.7 40.5,29.9 v1(38.5,29.9) ; J4.4 38.25,17.25 v1(38.45,17.05)
  Top Layer w0.3: J5.5 38.45,29.95 v1(38.5,29.9)
  Inner2 w0.3: 38,17.5 38,29.4 v1(38.5,29.9) ; 38,17.5 37.3,16.8 37.3,14 36.47,13.17 34.57,13.17 33.4,12 31.9,12 30.4,13.5 25.9,13.5 v1(21.6,17.8) ; 38,17.5 v1(38.45,17.05)
  Bottom Layer w0.23: v1(5.1,26.2) 5.9,25.4 11.9,25.4 v1(12.4,25.9)
  Bottom Layer w0.254: U2.15 16.72,9.53 18.4,11.2 18.4,14.2 21.6,17.4 v1(21.6,17.8)
RTS: length 11.7
  Top Layer w0.254: Q1.1 49.13,32.28 R14.2 49.13,29.63 48.4,28.9 48.4,25.7 v1(48.7,25.4) ; v1(46.6,24.9) 46.6,25.1 46,25.7 U4.6
  Inner2 w0.3: v1(46.6,24.9) 48.2,24.9 v1(48.7,25.4)
U0RXD: length 16.4
  Top Layer w0.254: U1.36 32.12,23.52 34.3,25.7 35.5,25.7 ; v1(40.4,25) 37.9,25 37.2,25.7 35.56,25.7
  Top Layer w0.35: U4.8 v1(44,27.85)
  Bottom Layer w0.254: v1(44,27.85) 41.15,25 v1(40.4,25)
U0TXD: length 14.5
  Top Layer w0.254: U1.37 32.69,24.78 34.1,26.2 36.9,26.2 38,27.3 39.5,27.3 40.3,28.1 42.6,28.1 43,27.7 U4.9
USB_D+: length 9.3
  Top Layer w0.253: 56.23,24.71 56.23,25.43 56.55,25.75 USB1.B6 58.8,25.75 v1(59,25.55) ; 56.23,24.71 56.52,24.71 56.56,24.75 USB1.A6 ; 56.23,24.71 54.39,22.87 54.39,22.44 54.35,22.4 U5.15
  Bottom Layer w0.253: v1(59,25.55) 59.15,25.55 59.2,25.5 59.68,25.5
USB_D-: length 8.3
  Top Layer w0.253: USB1.A7 58.25,25.25 58.6,24.9 v1(58.6,24.75) 58.6,24.6 58.25,24.25 USB1.B7 56.56,24.25 56.52,24.29 56.41,24.29 54.81,22.69 54.81,22.44 54.85,22.4 U5.14
  Bottom Layer w0.253: v1(58.6,24.75) 59.05,24.75 59.2,24.6 59.68,24.6
$1N14443: length 3.4
  Top Layer w0.6: J1.5 v1(28.5,5.9)
  Bottom Layer w0.5: v1(28.5,5.9) 28.5,5.4 C1.1 26.82,5.1 C3.1
$1N14452: length 3.2
  Top Layer w0.6: J1.4 v1(29.75,5.9)
  Bottom Layer w0.5: v1(29.75,5.9) 29.75,5.15 C8.1 31.08,5.1 C10.1
$1N14925: length 1.1
  Top Layer w0.3: v1(16.5,6.8) 16.4,6.7 C4.1
  vias: v1(16.5,5.9)
$1N14929: length 2.2
  Top Layer w0.3: C11.1 18.09,7.12 v1(17.74,6.77)
  Top Layer w0.35: v1(17.7,5.9) 17.7,4.9 J2.4
$1N47659: length 2.4
  Bottom Layer w0.254: R5.2 22.37,8.7 21.2,8.7 21.03,8.88 U2.3
$1N65530: length 7.9
  Top Layer w0.293: D8.1 48.62,10.03 J3.2 49.85,9.95 50.4,9.4 v1(50.4,8.8)
  Bottom Layer w0.293: v1(50.4,8.8) 50.1,8.5 48.4,8.5 48.2,8.3 48.2,7.73 R10.1
$1N65535: length 2.3
  Top Layer w0.293: D9.1 48.62,10.97 J3.1
$1N65539: length 2.4
  Top Layer w0.293: J3.8 48.57,3.22 D10.1
$2N8462: length 2.5
  Top Layer w0.254: USB1.A5 v1(58.7,23.75)
  Bottom Layer w0.254: R11.2 59.3,23.5 59.05,23.75 v1(58.7,23.75)
$2N8463: length 2.6
  Top Layer w0.254: USB1.B5 58.45,26.75 58.75,26.45 v1(59.1,26.45)
  Bottom Layer w0.254: v1(59.1,26.45) 59.15,26.4 59.57,26.4 59.77,26.6
$2N8466: length 7.7
  Top Layer w0.6: L1.1 v1(56.36,27.4) USB1.B4A9 ; USB1.A4B9 v1(56.35,22.6)
  Bottom Layer w0.8: v1(56.35,22.6) 56.35,27.39 v1(56.36,27.4)
$2N8479: length 3
  Top Layer w0.5: D12.2 56.3,30.6 56.05,30.35 F1.2
  Top Layer w0.8: L1.2 F1.2
$2N12270: length 2.7
  Top Layer w0.254: R13.1 48.3,34.97 48.3,33.4 48.7,33 Q1.2
$2N12271: length 2.9
  Top Layer w0.254: Q1.5 48,33 48.3,32.7 48.3,30.83 R14.1
$2N33095: length 1.4
  Top Layer w0.35: U8.1 51.5,26.6 51.27,26.37 50.7,26.37
$2N33161: length 2.2
  Top Layer w0.6: U8.3 53.95,24.52 L3.2
$2N33803: length 1.6
  Bottom Layer w0.254: R15.1 50.37,29.33 50.1,29.6 50.1,30 49.92,30.18 49.87,30.18 U6.1
$2N33808: length 2.8
  Bottom Layer w0.6: L2.2 46.98,32.25 U6.3
$2N33828: length 9.8
  Bottom Layer w0.35: U6.5 52.3,28.4 51.3,27.4 49,27.4 48.17,28.23 R18.2 R17.1 47.18,29.05 C22.1
$2N36848: length 6.2
  Top Layer w0.254: X1.3 50.3,19.78 50.38,19.7 51.2,19.7 51.4,19.5 51.4,18.1 52.4,17.1 53.7,17.1 53.85,17.25 U5.3
$2N36860: length 8.4
  Top Layer w0.254: U5.4 54.35,17.05 53.9,16.6 52,16.6 51.6,17 48.2,17 47.9,17.3 47.9,17.92 X1.1
$2N47446: length 1.7
  Top Layer w0.35: Q2.2 35.2,22.53 34.7,22.03 R20.2
$2N47448: length 2.1
  Top Layer w0.254: R23.2 33.7,24.3 34.35,24.95 Q2.1
$2N47466: length 5.6
  Top Layer w0.3: J4.9 37.95,19.75 38.1,19.9 38.1,20.8 37.6,21.3 37.6,23.6 Q2.3
$2N47561: length 8.2
  Top Layer w0.3: 49.6,26.37 49.13,26.37 48.9,26.6 48.9,28.4 49.7,29.2 U8.5
  Top Layer w0.5: 49.6,26.37 49.6,25.28 50.55,25.28 50.6,25.23
$3N2406: length 4.4
  Bottom Layer w0.3: R42.1 54.8,8.5 54,9.3 54,10.1 54.28,10.38 U11.3
$3N2407: length 2.1
  Bottom Layer w0.3: 55.55,9.72 55.6,9.67 55.6,9 55.9,8.7 R43.1
$3N2410: length 4.1
  Bottom Layer w0.254: U11.2 56.97,11.03 57.3,10.7 57.3,9.6 57.8,9.1 C79.2
$3N2416: length 1.1
  Bottom Layer w0.3: C72.2 54.8,6.87
$3N2417: length 1.1
  Bottom Layer w0.3: C73.2 55.9,6.87
$3N2422: length 2.5
  Bottom Layer w0.35: U11.8 50.32,11.67 49.7,12.3 R39.1
$3N2423: length 2.4
  Bottom Layer w0.35: R41.1 49.7,9.3 50.12,9.72 51.25,9.72
$3N2427: length 8.5
  Top Layer w0.35: J7.2 43.85,8.58 44.2,8.92 44.2,10.2 v1(45,11)
  Bottom Layer w0.35: v1(45,11) 45.2,11.2 46.8,11.2 47.7,10.3 C70.2 48.17,10.25 R41.2
$3N2428: length 7.7
  Top Layer w0.35: J7.1 42.85,10.45 44.3,11.9 v1(45.3,11.9)
  Bottom Layer w0.35: C71.2 48.12,12.25 R39.2 47.5,12.3 47.1,11.9 v1(45.3,11.9)
$3N2435: length 4
  Bottom Layer w0.2: U9.11 44.3,10.8 44.92,10.18 C52.2
  Bottom Layer w0.293: C52.2 44.95,9.63 46,9.63
$3N2451: length 4.1
  Bottom Layer w0.2: U9.12 43.9,11.2 42.8,10.1 C46.2
  Bottom Layer w0.254: C53.2 C46.2
$3N2452: length 4.8
  Bottom Layer w0.2: C47.2 41.8,10.5 42.2,10.9 43,10.9 43.5,11.4 U9.13
  Bottom Layer w0.254: C54.2 C47.2
$3N2454: length 1.2
  Bottom Layer w0.254: R29.1 C47.1
$3N2455: length 1.2
  Bottom Layer w0.254: R31.1 C46.1
$3N2462: length 2.6
  Bottom Layer w0.2: 42.6,12.3 41.8,12.3 41.35,11.85 C44.2
$3N2464: length 3.9
  Bottom Layer w0.2: U9.14 43.1,11.6 42.86,11.36 41.44,11.36 40.93,10.85 C45.2
$3N2466: length 1.9
  Bottom Layer w0.2: U9.16 41.2,13 41,12.8 40.28,12.8 C42.2
$3N2469: length 6.4
  Top Layer w0.3: MIC1.1 37.53,0.97 v1(37.5,1)
  Bottom Layer w0.3: R49.2 36.77,2.95 C85.2 36.7,2.88 36.7,1.8 v1(37.5,1)
$3N16346: length 10
  Bottom Layer w0.5: R44.1 53.69,14.1 53.67,14.12 C74.2 52.9,13.4 53.3,13 53.3,10.9 52.78,10.38 U11.6
$3N36391: length 3.9
  Top Layer w0.4: v1(41.4,2.4) 40.78,2.4 MIC1.4
  Bottom Layer w0.3: v1(41.4,2.4) 41.4,3 41.42,3.02 C84.2 43.45,3.02 43.5,3.07
$3N39755: length 2.5
  Bottom Layer w0.2: U10.1 31.2,20 32.1,19.1 32.1,18.13
$3N39760: length 2.1
  Bottom Layer w0.2: 31.1,18.13 31.1,18.9 30.5,19.5 U10.2
$3N43920: length 2.7
  Bottom Layer w0.2: C65.2 26.1,24.7 26.3,24.5 26.3,24.2 27.1,23.4 U10.16
$3N43925: length 2.3
  Bottom Layer w0.2: C66.2 26,23.7 26.7,23 U10.15
$3N44013: length 3.7
  Bottom Layer w0.2: C59.1 25.5,25.6 25.8,25.3 26.4,25.3 27.7,24 U10.17
$3N44017: length 3.3
  Bottom Layer w0.2: C60.1 26.5,25.8 27.6,24.7 28.3,24.7 28.5,24.5 U10.18
$3N44121: length 3
  Bottom Layer w0.2: U10.19 28.9,24.7 28.5,25.1 27.8,25.1 27.55,25.35 27.55,25.97 C61.2
$3N44127: length 2.3
  Bottom Layer w0.2: U10.20 29.3,24.9 28.5,25.7 C58.2
$3N44216: length 6.3
  Bottom Layer w0.2: C49.1 29.5,25.5 30.1,24.9 U10.22 ; U10.23 C48.1
  Bottom Layer w0.254: R30.1 31.45,26.02 C48.1 C49.1
$3N44433: length 3.6
  Bottom Layer w0.2: C41.1 32.9,25.4 31.5,24 U10.25
$3N44466: length 3.4
  Bottom Layer w0.2: C40.1 32.7,24.4 32.2,23.9 32.2,23.2 32,23 U10.26
$3N44552: length 2.7
  Bottom Layer w0.2: C39.1 33,23.4 32.2,22.6 U10.27
$3N44557: length 2.5
  Bottom Layer w0.2: U10.28 32.5,22.2 32.7,22.4 C37.1
$3N44677: length 2.6
  Bottom Layer w0.2: U10.29 32.7,21.8 33.1,21.4 C35.1
$3N44682: length 2.8
  Bottom Layer w0.2: C34.1 33.87,20.45 33.45,20.45 32.5,21.4 U10.30
$3N44790: length 3.4
  Bottom Layer w0.2: U10.31 32.3,21 33.1,20.2 33.1,19.6 33.3,19.4 C36.2
$3N44795: length 3.4
  Bottom Layer w0.2: U10.32 32,20.6 32.6,20 32.6,19.3 33.1,18.8 C38.2
$3N44900: length 5.7
  Top Layer w0.3: MIC1.3 42.4,1.5 ; 42.4,1.5 42.38,1.53 v1(41.53,1.53) ; 42.4,1.5 MIC1.2
  Bottom Layer w0.3: v1(41.53,1.53) 40.57,1.53 40.03,2.07 R52.2 R50.2
$3N45320: length 7.3
  Top Layer w0.254: MIC2.1 v1(62.3,33.53)
  Bottom Layer w0.3: R45.2 C82.2
  Bottom Layer w0.35: v1(62.3,33.53) 62.3,34.6 61.6,35.3 60.6,35.3 60.1,34.8 60.1,33.64 60.12,33.62 C82.2
$3N45324: length 3.9
  Top Layer w0.254: MIC2.4 62.87,32.5 v1(62.3,32.5)
  Bottom Layer w0.3: v1(62.3,32.5) 62.8,32 C80.1 62.75,31.43 R47.1
$3N45338: length 4
  Top Layer w0.254: MIC2.3 60.83,32.4 60.2,32.4 59.9,32.1 v1(59.9,32.08)
  Top Layer w0.3: MIC2.2 MIC2.3
  Bottom Layer w0.3: v1(59.9,32.08) 59.8,31.97 R48.2 R46.2
$3N50539: length 2.5
  Bottom Layer w0.2: R37.2 25.47,22.74 26.06,22.74 27,21.8 U10.12
$3N50544: length 2.2
  Bottom Layer w0.2: R36.2 26.1,21.7 26.4,21.4 U10.11

## Copper pours and planes (outline as drawn; the poured copper is in the pictures)
GND on Top Layer: 0,36 64,36 64,0 0,0
GND on Bottom Layer: 0,36 64,36 64,0 0,0
GND on Bottom Layer: 56.98,21.3 59.3,21.3 59.3,16.52 56.98,16.52
GND on Bottom Layer: 50.25,7 51.8,7 51.8,5.6 50.25,5.6
GND on Inner1: 0,36 64,36 64,0 0,0
GND on Inner2: 0,36 64,36 64,0 0,0
VBUS on Top Layer: 55.13,32.26 57.4,32.26 57.4,31.4 55.13,31.4
VBUS on Bottom Layer: 57.85,14.35 58.64,14.35 58.64,12.29 57.85,12.29
VBUS on Bottom Layer: 15.6,2.94 16.6,2.94 16.6,1.2 15.6,1.2
VBUS on Bottom Layer: 27.7,3.5 28.7,3.5 28.7,1.7 27.7,1.7
VBUS on Bottom Layer: 55.3,32.4 57.4,32.4 57.4,31.4 55.3,31.4
VBUS on Inner2: 27.69,3.14 28.7,3.14 28.7,1.7 27.69,1.7
VBUS on Inner2: 15.6,2.57 16.6,2.57 16.6,1.1 15.6,1.1
AU_GND on Top Layer: 58.9,36 64,36 64,29.55 58.9,29.55
AU_GND on Bottom Layer: 37.29,17.75 64,17.75 64,0 37.29,0
AU_GND on Bottom Layer: 58.9,36 64,36 64,29.55 58.9,29.55
AU_GND on Inner1: 58.9,36 64,36 64,29.55 58.9,29.55
AU_GND on Inner2: 58.9,36 64,36 64,29.55 58.9,29.55
AU_GND on Inner2: 24.2,31.2 37.67,31.2 37.67,14.17 24.2,14.17
AU_GND on Inner2: 36.6,18.2 64,18.2 64,0 36.6,0
$1N14925 on Top Layer: 16.1,7.09 16.9,7.09 16.9,4.2 16.1,4.2
$1N14925 on Bottom Layer: 15.6,7.1 16.8,7.1 16.8,4.1 15.6,4.1
$1N14929 on Top Layer: 17.38,7.09 18.1,7.09 18.1,5.1 17.38,5.1
$1N14929 on Bottom Layer: 17.38,7.09 18.09,7.09 18.09,4.28 17.38,4.28

Small or netless copper shapes (teardrops, artwork), in the pictures only: 1 on Bottom Layer

## Text on the board
Bottom Silkscreen Layer: 3V3 | V1.0 | RESET | MIC1 | BOOT | MIC2 | 5V | GND | IO10 | IO11 | SDA | SCL | ESP32-S3
Top Silkscreen Layer: 24 | 1 | 12 | 13
